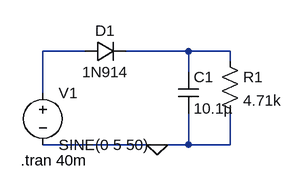
[diagram p0: schematic Draft1.asc]
Draft1.asc, the LTspice schematic file:
Version 4
SHEET 1 880 680
WIRE 192 80 128 80
WIRE 352 80 256 80
WIRE 416 80 352 80
WIRE 416 96 416 80
WIRE 352 112 352 80
WIRE 128 144 128 80
WIRE 304 224 128 224
WIRE 352 224 352 176
WIRE 352 224 304 224
WIRE 416 224 416 176
WIRE 416 224 352 224
FLAG 304 224 0
SYMBOL voltage 128 128 R0
WINDOW 123 0 0 Left 2
WINDOW 39 0 0 Left 2
SYMATTR InstName V1
SYMATTR Value SINE(0 5 50)
SYMBOL diode 192 96 R270
WINDOW 0 32 32 VTop 2
WINDOW 3 0 32 VBottom 2
SYMATTR InstName D1
SYMATTR Value 1N914
SYMBOL cap 336 112 R0
SYMATTR InstName C1
SYMATTR Value 10.1µ
SYMBOL res 400 80 R0
SYMATTR InstName R1
SYMATTR Value 4.71k
TEXT 94 248 Left 2 !.tran 40m

The netlist it stands for:
* Draft1.asc
V1 N001 0 SINE(0 5 50)
D1 N001 N002 1N914
C1 N002 0 10.1µ
R1 N002 0 4.71k
.model D D
.lib standard.dio
.tran 40m
.backanno
.end